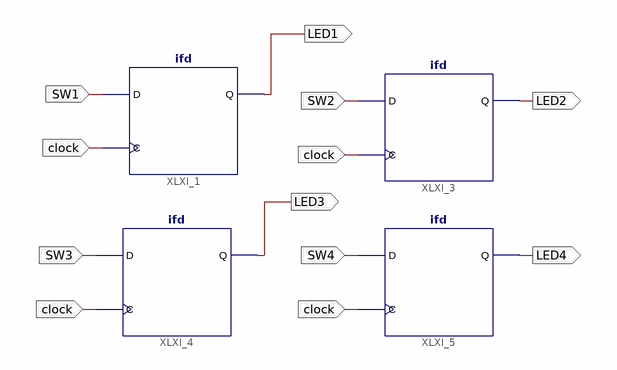
[diagram p0: schematic sheet 1]
// Xilinx ISE schematic schDoc.sch (spartan3e) as structural Verilog: 4 symbols, 9 ports
module schDoc (
  input  SW1,
  input  clock,
  input  SW3,
  input  SW2,
  input  SW4,
  output LED1,
  output LED3,
  output LED2,
  output LED4
);

  ifd XLXI_1 (.C(clock), .D(SW1), .Q(LED1));
  ifd XLXI_3 (.C(clock), .D(SW2), .Q(LED2));
  ifd XLXI_4 (.C(clock), .D(SW3), .Q(LED3));
  ifd XLXI_5 (.C(clock), .D(SW4), .Q(LED4));
endmodule
